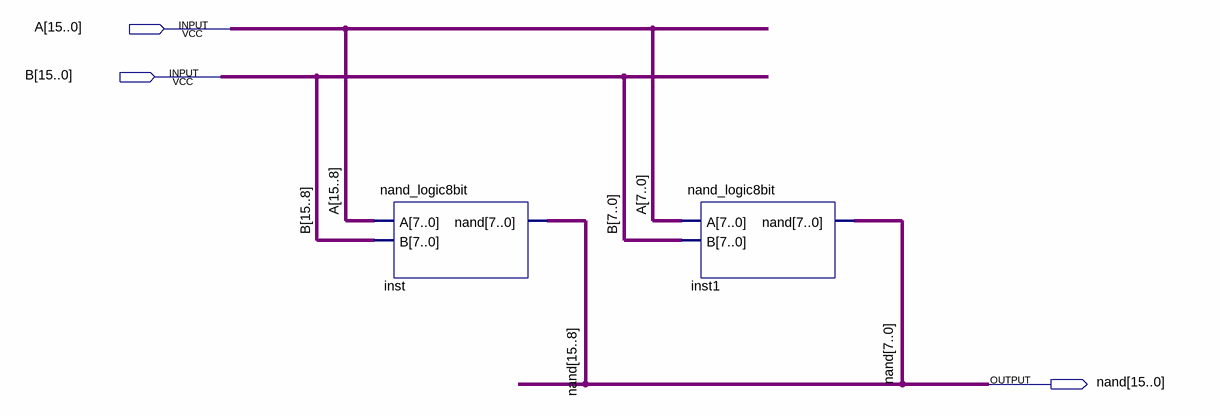
[diagram p0: schematic sheet]
// Quartus schematic nand_logic16bit.bdf as structural Verilog: 2 symbols, 3 pins
module nand_logic16bit (
  input  [15:0] A,
  input  [15:0] B,
  output [15:0] \nand 
);

  nand_logic8bit inst (.A(A[15:8]), .B(B[15:8]), .\nand (\nand [15:8]));
  nand_logic8bit inst1 (.A(A[7:0]), .B(B[7:0]), .\nand (\nand [7:0]));
endmodule
